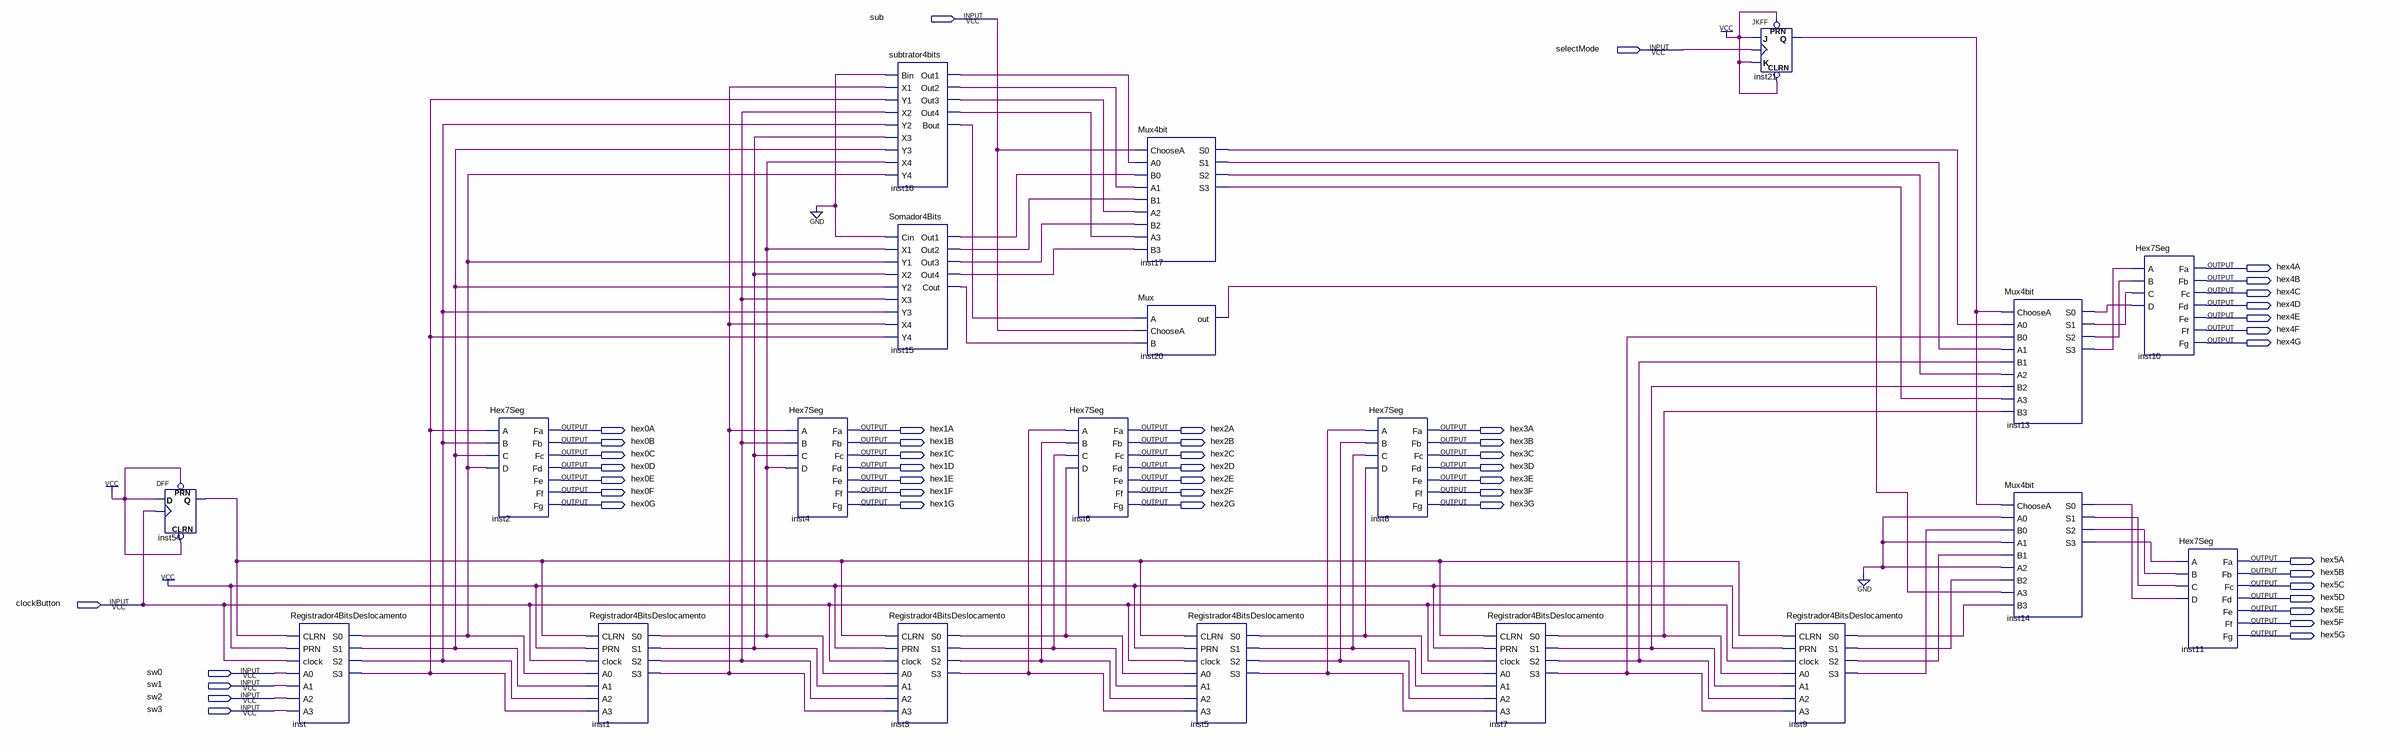
[diagram p0: schematic sheet]
// Quartus schematic A_MAQUINA_DE_FODER.bdf as structural Verilog: 20 symbols, 49 pins
module A_MAQUINA_DE_FODER (
  input  sub,
  input  selectMode,
  input  clockButton,
  input  sw0,
  input  sw1,
  input  sw2,
  input  sw3,
  output hex4A,
  output hex4B,
  output hex4C,
  output hex4D,
  output hex4E,
  output hex4F,
  output hex4G,
  output hex0A,
  output hex1A,
  output hex2A,
  output hex3A,
  output hex0B,
  output hex1B,
  output hex2B,
  output hex3B,
  output hex0C,
  output hex1C,
  output hex2C,
  output hex3C,
  output hex0D,
  output hex1D,
  output hex2D,
  output hex3D,
  output hex0E,
  output hex1E,
  output hex2E,
  output hex3E,
  output hex0F,
  output hex1F,
  output hex2F,
  output hex3F,
  output hex0G,
  output hex1G,
  output hex2G,
  output hex3G,
  output hex5A,
  output hex5B,
  output hex5C,
  output hex5D,
  output hex5E,
  output hex5F,
  output hex5G
);

  wire inst1_s0, inst1_s1, inst1_s2, inst1_s3, inst3_s0, inst3_s1, inst3_s2, inst3_s3, inst5_s0, inst5_s1,
       inst5_s2, inst5_s3, inst7_s0, inst7_s1, inst7_s2, inst7_s3, inst9_s0, inst9_s1, inst9_s2, inst9_s3,
       inst13_s0, inst13_s1, inst13_s2, inst13_s3, inst14_s0, inst14_s1, inst14_s2, inst14_s3, inst15_cout,
       inst15_out1, inst15_out2, inst15_out3, inst15_out4, inst16_bout, inst16_out1, inst16_out2,
       inst16_out3, inst16_out4, inst17_s0, inst17_s1, inst17_s2, inst17_s3, inst20_out, inst21_q, inst54_q,
       inst_s0, inst_s1, inst_s2, inst_s3;

  DFF inst54 (.CLRN(1'b1), .CLK(clockButton), .D(1'b1), .PRN(1'b1), .Q(inst54_q));
  Registrador4BitsDeslocamento inst (
    .CLRN(inst54_q), .PRN(1'b1), .clock(clockButton), .A0(sw0), .A1(sw1), .A2(sw2), .A3(sw3), .S0(inst_s0),
    .S1(inst_s1), .S2(inst_s2), .S3(inst_s3));
  Hex7Seg inst2 (
    .A(inst_s3), .B(inst_s2), .C(inst_s1), .D(inst_s0), .Fa(hex0A), .Fb(hex0B), .Fc(hex0C), .Fd(hex0D),
    .Fe(hex0E), .Ff(hex0F), .Fg(hex0G));
  Registrador4BitsDeslocamento inst1 (
    .CLRN(inst54_q), .PRN(1'b1), .clock(clockButton), .A0(inst_s0), .A1(inst_s1), .A2(inst_s2), .A3(inst_s3),
    .S0(inst1_s0), .S1(inst1_s1), .S2(inst1_s2), .S3(inst1_s3));
  Hex7Seg inst4 (
    .A(inst1_s3), .B(inst1_s2), .C(inst1_s1), .D(inst1_s0), .Fa(hex1A), .Fb(hex1B), .Fc(hex1C), .Fd(hex1D),
    .Fe(hex1E), .Ff(hex1F), .Fg(hex1G));
  subtrator4bits inst16 (
    .Bin(1'b0), .X1(inst1_s3), .Y1(inst_s3), .X2(inst1_s2), .Y2(inst_s2), .X3(inst1_s1), .Y3(inst_s1),
    .X4(inst1_s0), .Y4(inst_s0), .Out1(inst16_out1), .Out2(inst16_out2), .Out3(inst16_out3),
    .Out4(inst16_out4), .Bout(inst16_bout));
  Somador4Bits inst15 (
    .Cin(1'b0), .X1(inst1_s0), .Y1(inst_s0), .X2(inst1_s1), .Y2(inst_s1), .X3(inst1_s2), .Y3(inst_s2),
    .X4(inst1_s3), .Y4(inst_s3), .Out1(inst15_out1), .Out2(inst15_out2), .Out3(inst15_out3),
    .Out4(inst15_out4), .Cout(inst15_cout));
  Registrador4BitsDeslocamento inst3 (
    .CLRN(inst54_q), .PRN(1'b1), .clock(clockButton), .A0(inst1_s0), .A1(inst1_s1), .A2(inst1_s2),
    .A3(inst1_s3), .S0(inst3_s0), .S1(inst3_s1), .S2(inst3_s2), .S3(inst3_s3));
  Hex7Seg inst6 (
    .A(inst3_s3), .B(inst3_s2), .C(inst3_s1), .D(inst3_s0), .Fa(hex2A), .Fb(hex2B), .Fc(hex2C), .Fd(hex2D),
    .Fe(hex2E), .Ff(hex2F), .Fg(hex2G));
  Mux4bit inst17 (
    .ChooseA(sub), .A0(inst16_out1), .B0(inst15_out1), .A1(inst16_out2), .B1(inst15_out2), .A2(inst16_out3),
    .B2(inst15_out3), .A3(inst16_out4), .B3(inst15_out4), .S0(inst17_s0), .S1(inst17_s1), .S2(inst17_s2),
    .S3(inst17_s3));
  Mux inst20 (.A(inst16_bout), .ChooseA(sub), .B(inst15_cout), .out(inst20_out));
  Registrador4BitsDeslocamento inst5 (
    .CLRN(inst54_q), .PRN(1'b1), .clock(clockButton), .A0(inst3_s0), .A1(inst3_s1), .A2(inst3_s2),
    .A3(inst3_s3), .S0(inst5_s0), .S1(inst5_s1), .S2(inst5_s2), .S3(inst5_s3));
  Hex7Seg inst8 (
    .A(inst5_s3), .B(inst5_s2), .C(inst5_s1), .D(inst5_s0), .Fa(hex3A), .Fb(hex3B), .Fc(hex3C), .Fd(hex3D),
    .Fe(hex3E), .Ff(hex3F), .Fg(hex3G));
  Registrador4BitsDeslocamento inst7 (
    .CLRN(inst54_q), .PRN(1'b1), .clock(clockButton), .A0(inst5_s0), .A1(inst5_s1), .A2(inst5_s2),
    .A3(inst5_s3), .S0(inst7_s0), .S1(inst7_s1), .S2(inst7_s2), .S3(inst7_s3));
  JKFF inst21 (.PRN(1'b1), .CLRN(1'b1), .K(1'b1), .J(1'b1), .CLK(selectMode), .Q(inst21_q));
  Registrador4BitsDeslocamento inst9 (
    .CLRN(inst54_q), .PRN(1'b1), .clock(clockButton), .A0(inst7_s0), .A1(inst7_s1), .A2(inst7_s2),
    .A3(inst7_s3), .S0(inst9_s0), .S1(inst9_s1), .S2(inst9_s2), .S3(inst9_s3));
  Mux4bit inst13 (
    .ChooseA(inst21_q), .A0(inst17_s0), .B0(inst7_s3), .A1(inst17_s1), .B1(inst7_s2), .A2(inst17_s2),
    .B2(inst7_s1), .A3(inst17_s3), .B3(inst7_s0), .S0(inst13_s0), .S1(inst13_s1), .S2(inst13_s2),
    .S3(inst13_s3));
  Mux4bit inst14 (
    .ChooseA(inst21_q), .A0(1'b0), .B0(inst9_s3), .A1(1'b0), .B1(inst9_s2), .A2(1'b0), .B2(inst9_s1),
    .A3(inst20_out), .B3(inst9_s0), .S0(inst14_s0), .S1(inst14_s1), .S2(inst14_s2), .S3(inst14_s3));
  Hex7Seg inst10 (
    .A(inst13_s3), .B(inst13_s2), .C(inst13_s1), .D(inst13_s0), .Fa(hex4A), .Fb(hex4B), .Fc(hex4C),
    .Fd(hex4D), .Fe(hex4E), .Ff(hex4F), .Fg(hex4G));
  Hex7Seg inst11 (
    .A(inst14_s3), .B(inst14_s2), .C(inst14_s1), .D(inst14_s0), .Fa(hex5A), .Fb(hex5B), .Fc(hex5C),
    .Fd(hex5D), .Fe(hex5E), .Ff(hex5F), .Fg(hex5G));
endmodule
